# EAGLE schematic ADCS Motherboard (EAGLE 9.6.2)
DESIGNER: Thomas Christison; REV#: B

## Sheet 1 of 4
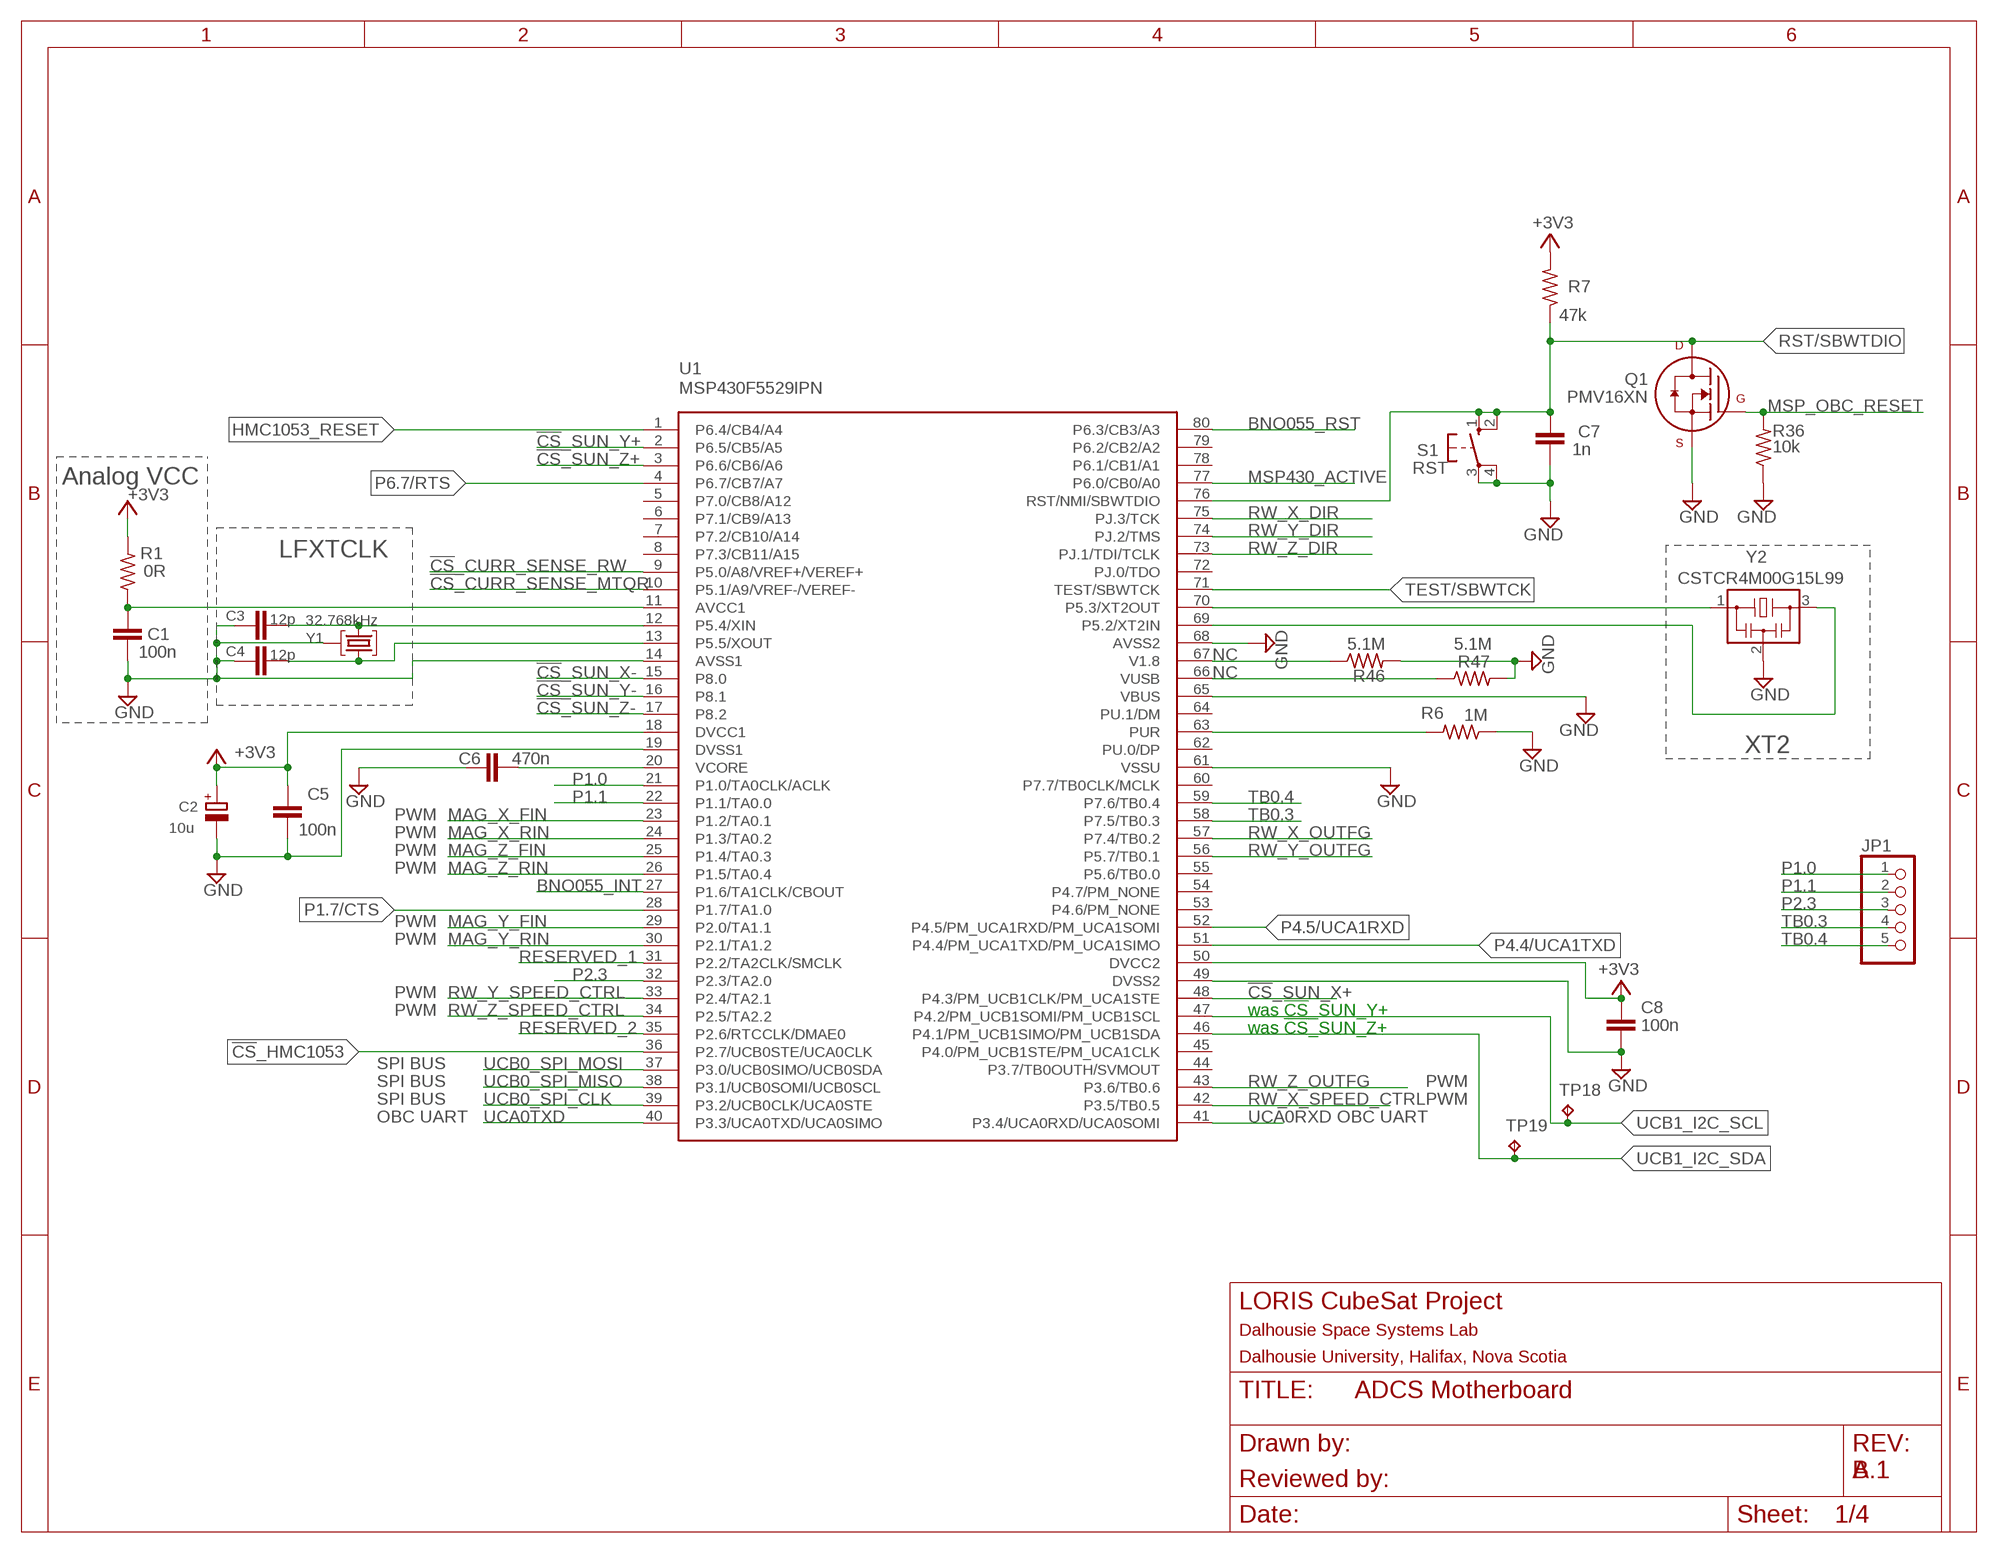
[diagram p0: schematic, sheet 1]

### Parts
C1  100n  C-EUC0402  [C0402]
C2  10u  POLARIZED_CAP  [A/3216-18R]
C3  12p  C-EUC0402  [C0402]
C4  12p  C-EUC0402  [C0402]
C5  100n  C-EUC0402  [C0402]
C6  470n  C-EUC0402  [C0402]
C7  1n  C-EUC0402  [C0402]
C8  100n  C-EUC0402  [C0402]
JP1  PINHD-1X5  [1X05]
Q1  PMV16XN  [SOT23-3P95_230X110L20X43N_PMV16XN]
R1  0R  R-US_R0402  [R0402]
R6  1M  R-US_R0603  [R0603]
R7  47k  R-US_R0402  [R0402]
R36  10k  R-US_R0603  [R0603]
R46  5.1M  R-US_R0402  [R0402]
R47  5.1M  R-US_R0402  [R0402]
S1  RST  10-XX  [B3F-10XX]
TP18  TESTPOINT  [TP_P76H50]
TP19  TESTPOINT  [TP_P76H50]
U1  MSP430F5529IPN  [QFP80P50_1400X1400X160L60X22N]
Y1  32.768kHz  MS3V-T1R  [MS3V-T1R]
Y2  CSTCR4M00G15L99  CSTCR4M00G15L996M00G53Z  [MURATA-FILTER_CSTCR]

### Nets
!CS!_CURR_SENSE_MTQR: U1.10(P5.1/A9/VREF-/VEREF-) ; also sheet 2
!CS!_CURR_SENSE_RW: U1.9(P5.0/A8/VREF+/VEREF+) ; also sheet 2
!CS!_HMC1053: U1.36(P2.7/UCB0STE/UCA0CLK) ; also sheet 3
!CS!_SUN_X+: U1.48(P4.3/PM_UCB1CLK/PM_UCA1STE) ; also sheet 2
!CS!_SUN_X-: U1.15(P8.0) ; also sheet 2
!CS!_SUN_Y+: U1.2(P6.5/CB5/A5) ; also sheet 2
!CS!_SUN_Y-: U1.16(P8.1) ; also sheet 2
!CS!_SUN_Z+: U1.3(P6.6/CB6/A6) ; also sheet 2
!CS!_SUN_Z-: U1.17(P8.2) ; also sheet 2
+3V3: C2.+ C5.2 C8.1 R1.2 R7.2 U1.18(DVCC1) U1.50(DVCC2) ; also sheet 2,3,4
AVCC1 [Power]: C1.1 R1.1 U1.11(AVCC1)
BNO055_INT: U1.27(P1.6/TA1CLK/CBOUT) ; also sheet 4
BNO055_RST: U1.80(P6.3/CB3/A3) ; also sheet 4
GND: C1.2 C2.- C3.1 C4.1 C5.1 C6.1 C7.2 C8.2 Q1.2(S) R6.1 R36.1 R46.2 R47.2 S1.3(P) S1.4(P1) U1.14(AVSS1) U1.19(DVSS1) U1.49(DVSS2) U1.61(VSSU) U1.65(VBUS) U1.68(AVSS2) Y1.P3(GND) Y2.2 ; also sheet 2,3,4
HMC1053_RESET: U1.1(P6.4/CB4/A4) ; also sheet 3
MAG_X_FIN: U1.23(P1.2/TA0.1) ; also sheet 2
MAG_X_RIN: U1.24(P1.3/TA0.2) ; also sheet 2
MAG_Y_FIN: U1.29(P2.0/TA1.1) ; also sheet 2
MAG_Y_RIN: U1.30(P2.1/TA1.2) ; also sheet 2
MAG_Z_FIN: U1.25(P1.4/TA0.3) ; also sheet 2
MAG_Z_RIN: U1.26(P1.5/TA0.4) ; also sheet 2
MSP430_ACTIVE: U1.77(P6.0/CB0/A0) ; also sheet 2
MSP_OBC_RESET: Q1.1(G) R36.2 ; also sheet 2
N$34: R46.1 U1.67(V1.8)
N$38: R47.1 U1.66(VUSB)
P1.0: JP1.1 U1.21(P1.0/TA0CLK/ACLK)
P1.1: JP1.2 U1.22(P1.1/TA0.0)
P1.7/CTS: U1.28(P1.7/TA1.0) ; also sheet 2
P2.3: JP1.3 U1.32(P2.3/TA2.0)
P4.4/UCA1TXD: U1.51(P4.4/PM_UCA1TXD/PM_UCA1SIMO) ; also sheet 2
P4.5/UCA1RXD: U1.52(P4.5/PM_UCA1RXD/PM_UCA1SOMI) ; also sheet 2
P5.2/XT2IN1: U1.69(P5.2/XT2IN) Y2.3
P5.3/XT2OUT1: U1.70(P5.3/XT2OUT) Y2.1
P5.4/XIN1: C3.2 U1.12(P5.4/XIN) Y1.P2
P5.5/XOUT1: C4.2 U1.13(P5.5/XOUT) Y1.P1
P6.7/RTS: U1.4(P6.7/CB7/A7) ; also sheet 2
RESERVED_1: U1.31(P2.2/TA2CLK/SMCLK) ; also sheet 2
RESERVED_2: U1.35(P2.6/RTCCLK/DMAE0) ; also sheet 2
RST/SBWTDIO: C7.1 Q1.3(D) R7.1 S1.1(S) S1.2(S1) U1.76(RST/NMI/SBWTDIO) ; also sheet 2
RW_X_DIR: U1.75(PJ.3/TCK) ; also sheet 2
RW_X_OUTFG: U1.57(P7.4/TB0.2) ; also sheet 2
RW_X_SPEED_CTRL: U1.42(P3.5/TB0.5) ; also sheet 2
RW_Y_DIR: U1.74(PJ.2/TMS) ; also sheet 2
RW_Y_OUTFG: U1.56(P5.7/TB0.1) ; also sheet 2
RW_Y_SPEED_CTRL: U1.33(P2.4/TA2.1) ; also sheet 2
RW_Z_DIR: U1.73(PJ.1/TDI/TCLK) ; also sheet 2
RW_Z_OUTFG: U1.43(P3.6/TB0.6) ; also sheet 2
RW_Z_SPEED_CTRL: U1.34(P2.5/TA2.2) ; also sheet 2
TARGET_PUR: R6.2 U1.63(PUR)
TB0.3: JP1.4 U1.58(P7.5/TB0.3)
TB0.4: JP1.5 U1.59(P7.6/TB0.4)
TEST/SBWTCK: U1.71(TEST/SBWTCK) ; also sheet 2
UCA0RXD: U1.41(P3.4/UCA0RXD/UCA0SOMI) ; also sheet 2
UCA0TXD: U1.40(P3.3/UCA0TXD/UCA0SIMO) ; also sheet 2
UCB0_SPI_CLK: U1.39(P3.2/UCB0CLK/UCA0STE) ; also sheet 2,3
UCB0_SPI_MISO: U1.38(P3.1/UCB0SOMI/UCB0SCL) ; also sheet 2,3
UCB0_SPI_MOSI: U1.37(P3.0/UCB0SIMO/UCB0SDA) ; also sheet 2,3
UCB1_I2C_SCL: TP18.1(TP) U1.47(P4.2/PM_UCB1SOMI/PM_UCB1SCL) ; also sheet 4
UCB1_I2C_SDA: TP19.1(TP) U1.46(P4.1/PM_UCB1SIMO/PM_UCB1SDA) ; also sheet 4
VCORE1 [Power]: C6.2 U1.20(VCORE)
Unconnected: U1.5(P7.0/CB8/A12) U1.6(P7.1/CB9/A13) U1.7(P7.2/CB10/A14) U1.8(P7.3/CB11/A15) U1.44(P3.7/TB0OUTH/SVMOUT) U1.45(P4.0/PM_UCB1STE/PM_UCA1CLK) U1.53(P4.6/PM_NONE) U1.54(P4.7/PM_NONE) U1.55(P5.6/TB0.0) U1.60(P7.7/TB0CLK/MCLK) U1.62(PU.0/DP) U1.64(PU.1/DM) U1.72(PJ.0/TDO) U1.78(P6.1/CB1/A1) U1.79(P6.2/CB2/A2)

### Notes on the sheet
- Analog VCC
- LFXTCLK
- NC
- NC
- XT2
- PWM
- PWM
- PWM
- PWM
- PWM
- PWM
- PWM
- PWM | was !CS!_SUN_Y+
- was !CS!_SUN_Z+
- SPI BUS
- SPI BUS | PWM
- SPI BUS | PWM
- OBC UART | OBC UART
- A.1

## Sheet 2 of 4
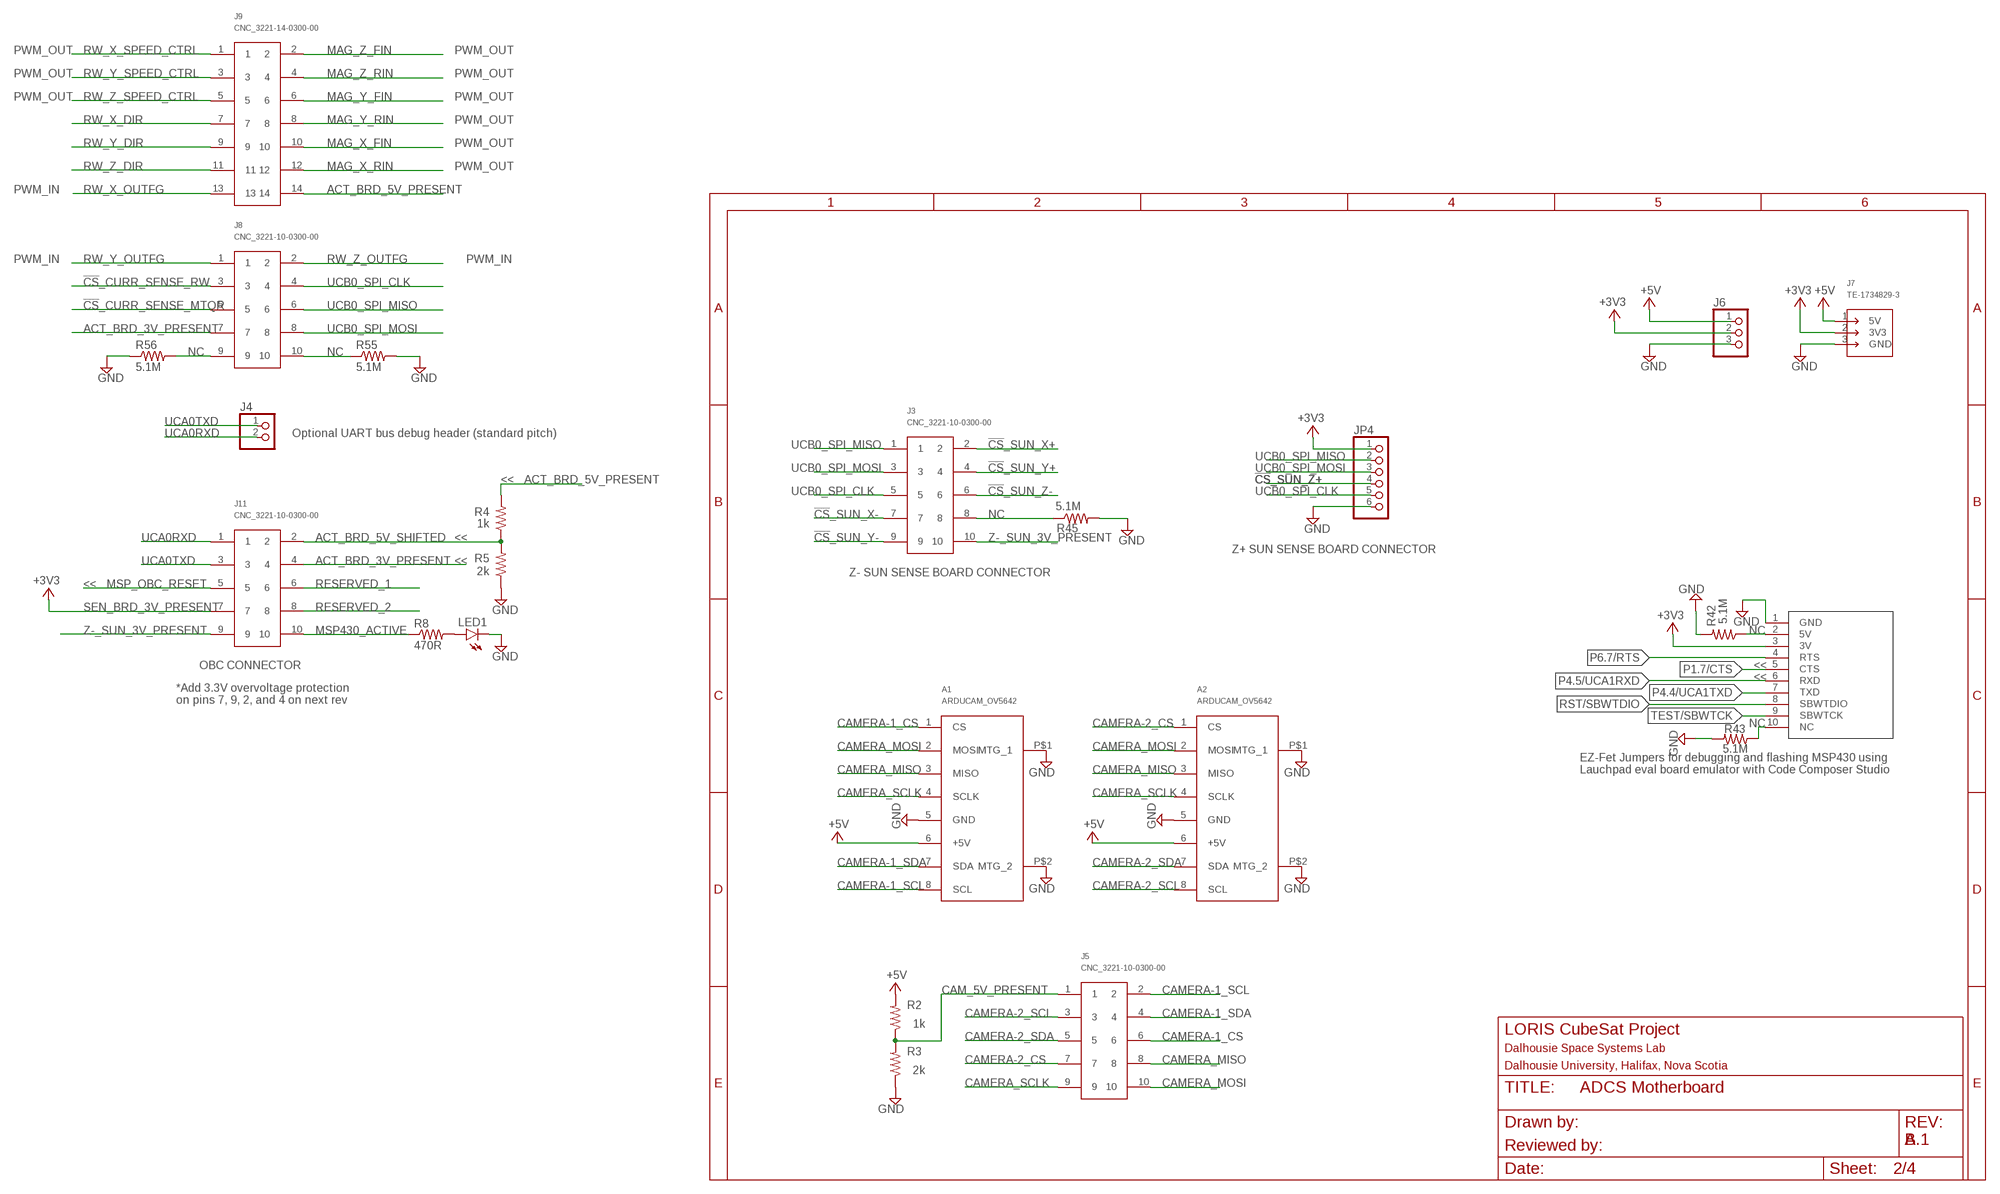
[diagram p1: schematic, sheet 2]

### Parts
A1  ARDUCAM_OV5642  [ARDUCAM]
A2  ARDUCAM_OV5642  [ARDUCAM]
J1  HDR_10_EZFET_DEBUGGER  [HDRV10W66P254_10X1_2540X254H858]
J3  CNC_3221-10-0300-00  [CNC_3221-10-0300-00]
J4  HDR_1X2_  [1X02]
J5  CNC_3221-10-0300-00  [CNC_3221-10-0300-00]
J6  PINHD-1X3  [1X03]
J7  TE-1734829-3  [TE-1734829-3]
J8  CNC_3221-10-0300-00  [CNC_3221-10-0300-00]
J9  CNC_3221-14-0300-00  [CNC_3221-14-0300-00]
J11  CNC_3221-10-0300-00  [CNC_3221-10-0300-00]
JP4  PINHD-1X6  [1X06]
LED1  LEDCHIP-LED0603  [CHIP-LED0603]
R2  1k  R-US_R0603  [R0603]
R3  2k  R-US_R0603  [R0603]
R4  1k  R-US_R0603  [R0603]
R5  2k  R-US_R0603  [R0603]
R8  470R  R-US_R0603  [R0603]
R42  5.1M  R-US_R0402  [R0402]
R43  5.1M  R-US_R0402  [R0402]
R45  5.1M  R-US_R0402  [R0402]
R55  5.1M  R-US_R0603  [R0603]
R56  5.1M  R-US_R0603  [R0603]

### Nets
!CS!_CURR_SENSE_MTQR: J8.5 ; also sheet 1
!CS!_CURR_SENSE_RW: J8.3 ; also sheet 1
!CS!_SUN_X+: J3.2 ; also sheet 1
!CS!_SUN_X-: J3.7 ; also sheet 1
!CS!_SUN_Y+: J3.4 ; also sheet 1
!CS!_SUN_Y-: J3.9 ; also sheet 1
!CS!_SUN_Z+: JP4.4 ; also sheet 1
!CS!_SUN_Z-: J3.6 ; also sheet 1
+3V3: J1.3(3V) J6.2 J7.2(3V3) J11.7 JP4.1 ; also sheet 1,3,4
+5V: A1.6(+5V) A2.6(+5V) J6.1 J7.1(5V) R2.2 ; also sheet 4
ACT_BRD_3V_PRESENT: J8.7 J11.4
ACT_BRD_5V_PRESENT: J9.14 R4.2
ACT_BRD_5V_SHIFTED: J11.2 R4.1 R5.2
CAM_5V_PRESENT: J5.1 R2.1 R3.2
CAMERA-1_CS: A1.1(CS) J5.6
CAMERA-1_SCL: A1.8(SCL) J5.2
CAMERA-1_SDA: A1.7(SDA) J5.4
CAMERA-2_CS: A2.1(CS) J5.7
CAMERA-2_SCL: A2.8(SCL) J5.3
CAMERA-2_SDA: A2.7(SDA) J5.5
CAMERA_MISO: A1.3(MISO) A2.3(MISO) J5.8
CAMERA_MOSI: A1.2(MOSI) A2.2(MOSI) J5.10
CAMERA_SCLK: A1.4(SCLK) A2.4(SCLK) J5.9
GND: A1.5(GND) A1.P$1(MTG_1) A1.P$2(MTG_2) A2.5(GND) A2.P$1(MTG_1) A2.P$2(MTG_2) J1.1(GND) J6.3 J7.3(GND) JP4.6 LED1.C R3.1 R5.1 R42.2 R43.2 R45.2 R55.2 R56.1 ; also sheet 1,3,4
MAG_X_FIN: J9.10 ; also sheet 1
MAG_X_RIN: J9.12 ; also sheet 1
MAG_Y_FIN: J9.6 ; also sheet 1
MAG_Y_RIN: J9.8 ; also sheet 1
MAG_Z_FIN: J9.2 ; also sheet 1
MAG_Z_RIN: J9.4 ; also sheet 1
MSP430_ACTIVE: J11.10 R8.1 ; also sheet 1
MSP_OBC_RESET: J11.5 ; also sheet 1
N$4: LED1.A R8.2
N$32: J1.2(5V) R42.1
N$33: J1.10(NC) R43.1
N$55: J8.9 R56.2
N$57: J8.10 R55.1
N$58: J3.8 R45.1
P1.7/CTS: J1.5(CTS) ; also sheet 1
P4.4/UCA1TXD: J1.7(TXD) ; also sheet 1
P4.5/UCA1RXD: J1.6(RXD) ; also sheet 1
P6.7/RTS: J1.4(RTS) ; also sheet 1
RESERVED_1: J11.6 ; also sheet 1
RESERVED_2: J11.8 ; also sheet 1
RST/SBWTDIO: J1.8(SBWTDIO) ; also sheet 1
RW_X_DIR: J9.7 ; also sheet 1
RW_X_OUTFG: J9.13 ; also sheet 1
RW_X_SPEED_CTRL: J9.1 ; also sheet 1
RW_Y_DIR: J9.9 ; also sheet 1
RW_Y_OUTFG: J8.1 ; also sheet 1
RW_Y_SPEED_CTRL: J9.3 ; also sheet 1
RW_Z_DIR: J9.11 ; also sheet 1
RW_Z_OUTFG: J8.2 ; also sheet 1
RW_Z_SPEED_CTRL: J9.5 ; also sheet 1
TEST/SBWTCK: J1.9(SBWTCK) ; also sheet 1
UCA0RXD: J4.2 J11.1 ; also sheet 1
UCA0TXD: J4.1 J11.3 ; also sheet 1
UCB0_SPI_CLK: J3.5 J8.4 JP4.5 ; also sheet 1,3
UCB0_SPI_MISO: J3.1 J8.6 JP4.2 ; also sheet 1,3
UCB0_SPI_MOSI: J3.3 J8.8 JP4.3 ; also sheet 1,3
Z-_SUN_3V_PRESENT: J3.10 J11.9

### Notes on the sheet
- PWM_OUT | PWM_OUT
- PWM_OUT | PWM_OUT
- PWM_OUT | PWM_OUT
- PWM_OUT
- PWM_OUT
- PWM_OUT
- PWM_IN
- PWM_IN | PWM_IN
- NC | NC
- Optional UART bus debug header (standard pitch)
- <<
- NC
- <<
- Z+ SUN SENSE BOARD CONNECTOR
- <<
- Z- SUN SENSE BOARD CONNECTOR
- <<
- SEN_BRD_3V_PRESENT
- NC
- OBC CONNECTOR | <<
- <<
- *Add 3.3V overvoltage protection 
  on pins 7, 9, 2, and 4 on next rev
- NC
- EZ-Fet Jumpers for debugging and flashing MSP430 using 
  Lauchpad eval board emulator with Code Composer Studio
- A.1

## Sheet 3 of 4
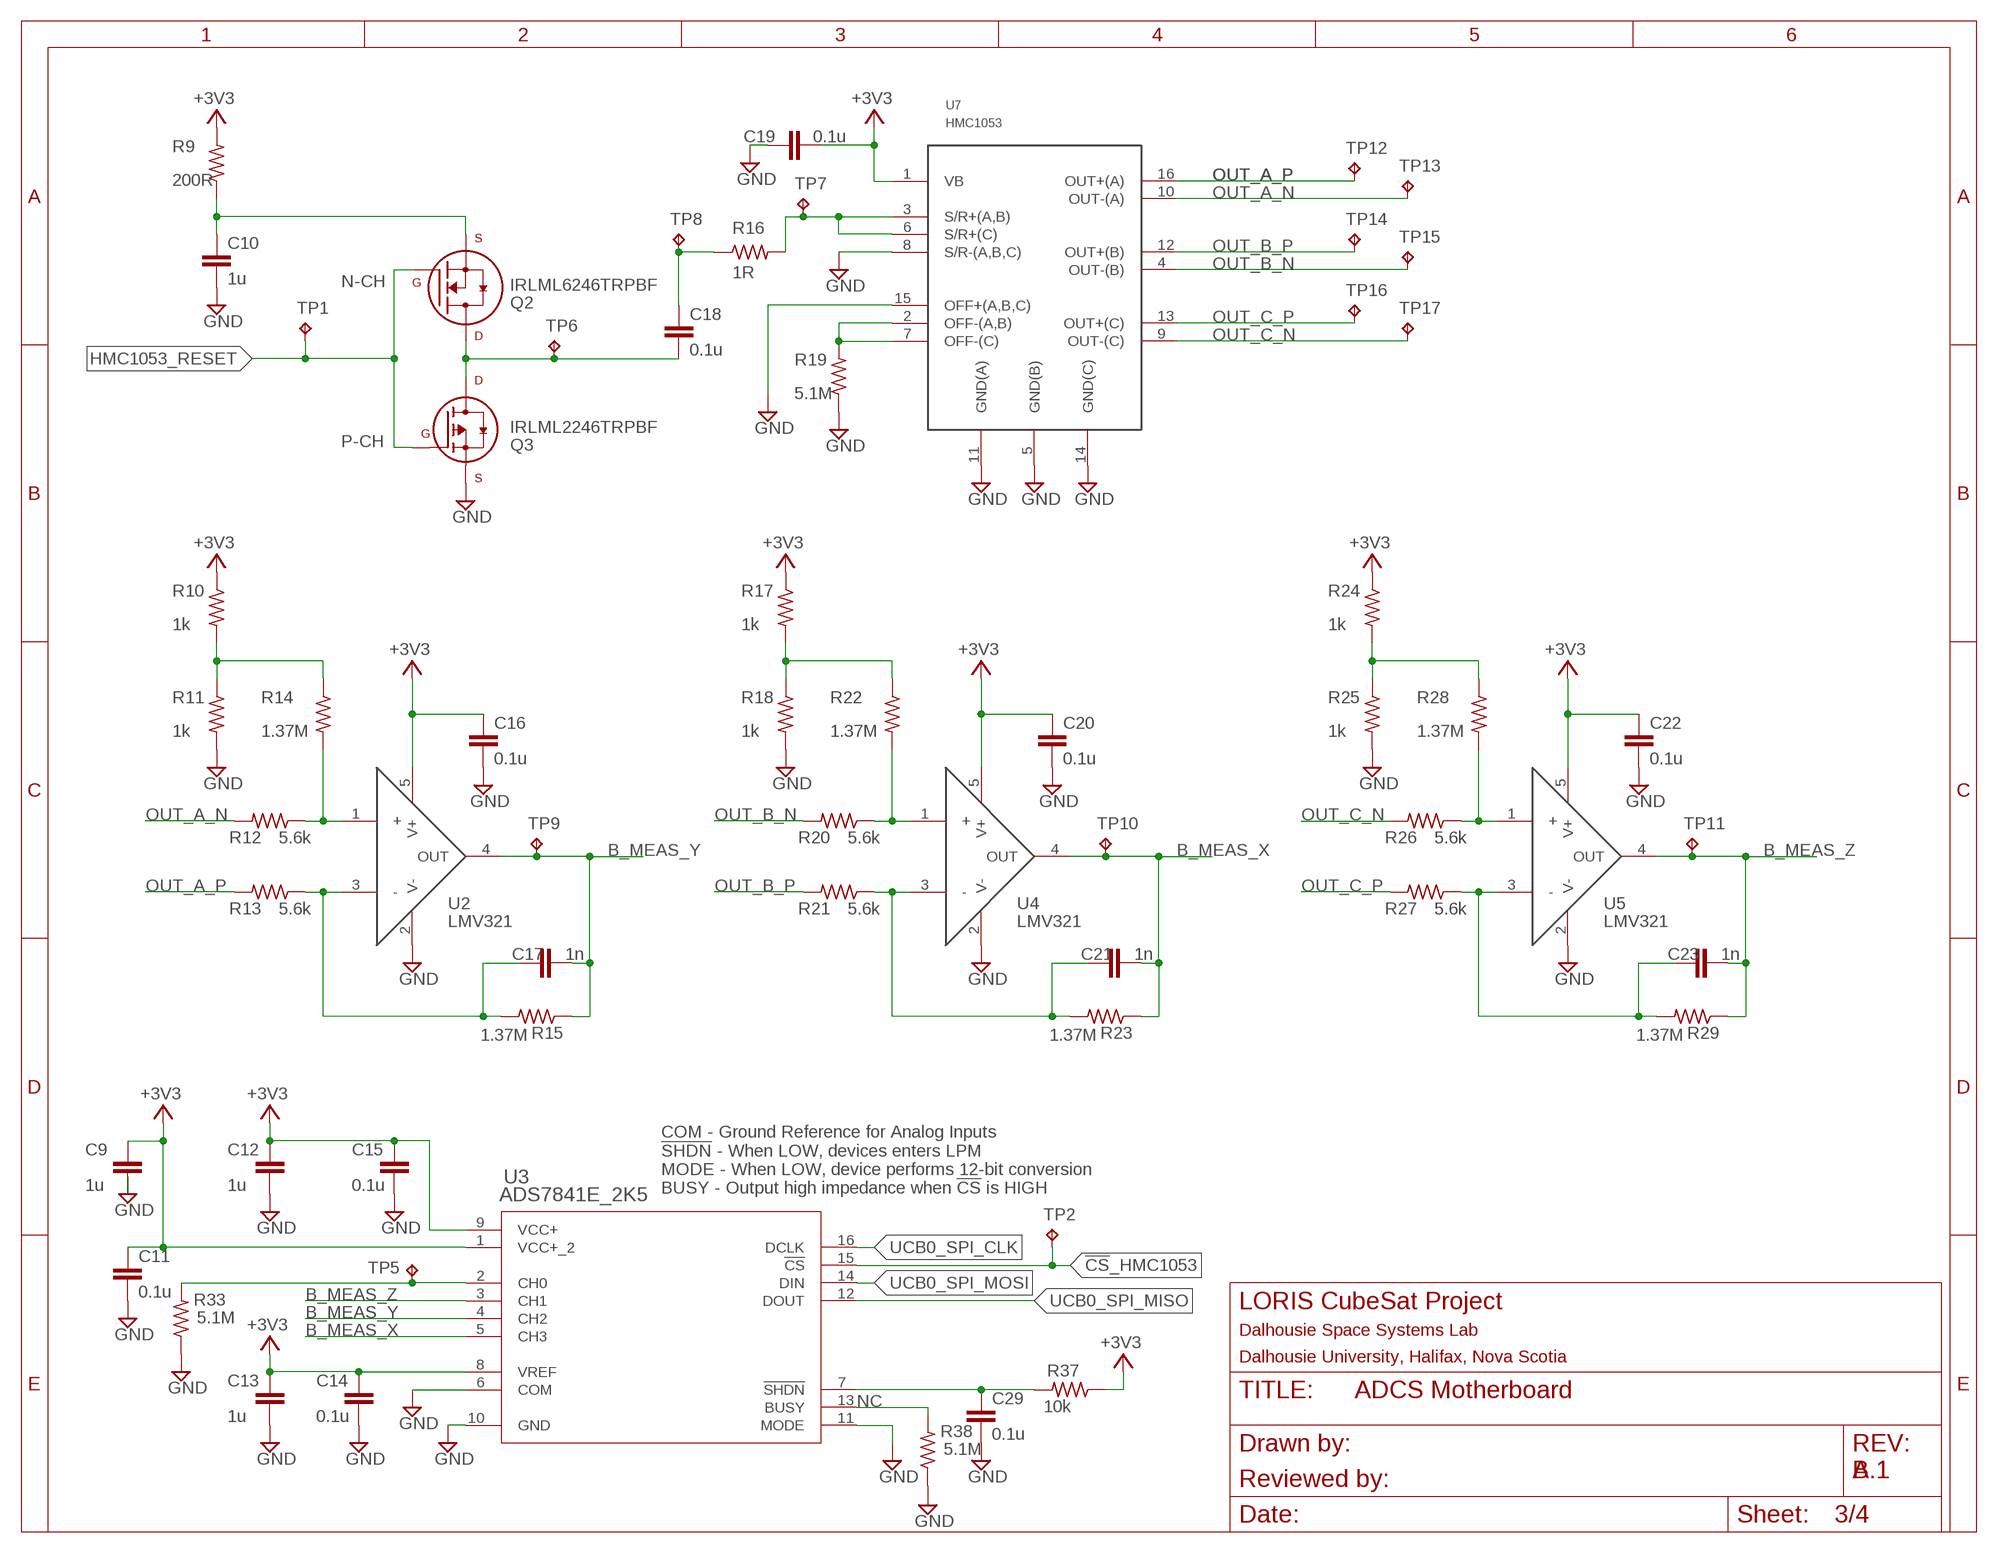
[diagram p2: schematic, sheet 3]

### Parts
C9  1u  C-EUC0805  [C0805]
C10  1u  C-EUC0603  [C0603]
C11  0.1u  C-EUC0603  [C0603]
C12  1u  C-EUC0805  [C0805]
C13  1u  C-EUC0805  [C0805]
C14  0.1u  C-EUC0603  [C0603]
C15  0.1u  C-EUC0603  [C0603]
C16  0.1u  C-EUC0603  [C0603]
C17  1n  C-EUC0603  [C0603]
C18  0.1u  C-EUC0805  [C0805]
C19  0.1u  C-EUC0603  [C0603]
C20  0.1u  C-EUC0603  [C0603]
C21  1n  C-EUC0603  [C0603]
C22  0.1u  C-EUC0603  [C0603]
C23  1n  C-EUC0603  [C0603]
C29  0.1u  C-EUC0603  [C0603]
Q2  IRLML6246TRPBF  [SOT23-3P95_237X112L25X40N_MICRO3]
Q3  IRLML2246TRPBF  [SOT23-3P95_237X112L25X40N_MICRO3]
R9  200R  R-US_R0805  [R0805]
R10  1k  R-US_R0603  [R0603]
R11  1k  R-US_R0603  [R0603]
R12  5.6k  R-US_R0603  [R0603]
R13  5.6k  R-US_R0603  [R0603]
R14  1.37M  R-US_R0603  [R0603]
R15  1.37M  R-US_R0603  [R0603]
R16  1R  R-US_R0805  [R0805]
R17  1k  R-US_R0603  [R0603]
R18  1k  R-US_R0603  [R0603]
R19  5.1M  R-US_R0805  [R0805]
R20  5.6k  R-US_R0603  [R0603]
R21  5.6k  R-US_R0603  [R0603]
R22  1.37M  R-US_R0603  [R0603]
R23  1.37M  R-US_R0603  [R0603]
R24  1k  R-US_R0603  [R0603]
R25  1k  R-US_R0603  [R0603]
R26  5.6k  R-US_R0603  [R0603]
R27  5.6k  R-US_R0603  [R0603]
R28  1.37M  R-US_R0603  [R0603]
R29  1.37M  R-US_R0603  [R0603]
R33  5.1M  R-US_R0402  [R0402]
R37  10k  R-US_R0805  [R0805]
R38  5.1M  R-US_R0402  [R0402]
TP1  TESTPOINT  [TP_P76H50]
TP2  TESTPOINT  [TP_P76H50]
TP5  TESTPOINT  [TP_P76H50]
TP6  TESTPOINT  [TP_P76H50]
TP7  TESTPOINT  [TP_P76H50]
TP8  TESTPOINT  [TP_P76H50]
TP9  TESTPOINT  [TP_P76H50]
TP10  TESTPOINT  [TP_P76H50]
TP11  TESTPOINT  [TP_P76H50]
TP12  TESTPOINT  [TP_P76H50]
TP13  TESTPOINT  [TP_P76H50]
TP14  TESTPOINT  [TP_P76H50]
TP15  TESTPOINT  [TP_P76H50]
TP16  TESTPOINT  [TP_P76H50]
TP17  TESTPOINT  [TP_P76H50]
U2  LMV321  [SC70-5P65_210X110L36X22N]
U3  ADS7841E_2K5  [DBQ16]
U4  LMV321  [SC70-5P65_210X110L36X22N]
U5  LMV321  [SC70-5P65_210X110L36X22N]
U7  HMC1053  [LCCS16P127_736X736X279L127X50N]

### Nets
!CS!_HMC1053: TP2.1(TP) U3.15(!CS) ; also sheet 1
+3V3: C9.1 C11.1 C12.1 C13.1 C14.1 C15.1 C16.1 C19.1 C20.1 C22.1 R9.2 R10.1 R17.1 R24.1 R37.1 U2.5(V+) U3.1(VCC+_2) U3.8(VREF) U3.9(VCC+) U4.5(V+) U5.5(V+) U7.1(VB) ; also sheet 1,2,4
B_MEAS_X: C21.2 R23.1 TP10.1(TP) U3.5(CH3) U4.4(OUT)
B_MEAS_Y: C17.2 R15.1 TP9.1(TP) U2.4(OUT) U3.4(CH2)
B_MEAS_Z: C23.2 R29.1 TP11.1(TP) U3.3(CH1) U5.4(OUT)
GND: C9.2 C10.1 C11.2 C12.2 C13.2 C14.2 C15.2 C16.2 C19.2 C20.2 C22.2 C29.2 Q3.2(S) R11.2 R18.2 R19.1 R25.2 R33.1 R38.1 U2.2(V-) U3.6(COM) U3.10(GND) U3.11(MODE) U4.2(V-) U5.2(V-) U7.5(GND(B)) U7.8(S/R-(A,B,C)) U7.11(GND(A)) U7.14(GND(C)) U7.15(OFF+(A,B,C)) ; also sheet 1,2,4
HMC1053_RESET: Q2.1(G) Q3.1(G) TP1.1(TP) ; also sheet 1
N$9: C18.1 Q2.3(D) Q3.3(D) TP6.1(TP)
N$20: R10.2 R11.1 R14.1
N$21: C17.1 R13.1 R15.2 U2.3(-)
N$23: R12.1 R14.2 U2.1(+)
N$29: R33.2 TP5.1(TP) U3.2(CH0)
N$30: R38.2 U3.13(BUSY)
N$31: C29.1 R37.2 U3.7(!SHDN)
N$35: C18.2 R16.1 TP8.1(TP)
N$36: R19.2 U7.2(OFF-(A,B)) U7.7(OFF-(C))
N$37: R16.2 TP7.1(TP) U7.3(S/R+(A,B)) U7.6(S/R+(C))
N$39: C10.2 Q2.2(S) R9.1
N$49: R17.2 R18.1 R22.1
N$50: C21.1 R21.1 R23.2 U4.3(-)
N$52: R20.1 R22.2 U4.1(+)
N$59: R24.2 R25.1 R28.1
N$60: C23.1 R27.1 R29.2 U5.3(-)
N$62: R26.1 R28.2 U5.1(+)
OUT_A_N: R12.2 TP13.1(TP) U7.10(OUT-(A))
OUT_A_P: R13.2 TP12.1(TP) U7.16(OUT+(A))
OUT_B_N [Ground]: R20.2 TP15.1(TP) U7.4(OUT-(B))
OUT_B_P [Ground]: R21.2 TP14.1(TP) U7.12(OUT+(B))
OUT_C_N [Ground]: R26.2 TP17.1(TP) U7.9(OUT-(C))
OUT_C_P [Ground]: R27.2 TP16.1(TP) U7.13(OUT+(C))
UCB0_SPI_CLK: U3.16(DCLK) ; also sheet 1,2
UCB0_SPI_MISO: U3.12(DOUT) ; also sheet 1,2
UCB0_SPI_MOSI: U3.14(DIN) ; also sheet 1,2

### Notes on the sheet
- N-CH
- P-CH
- COM - Ground Reference for Analog Inputs
  !SHDN! - When LOW, devices enters LPM
  MODE - When LOW, device performs 12-bit conversion
  BUSY - Output high impedance when !CS! is HIGH
- NC
- A.1

## Sheet 4 of 4
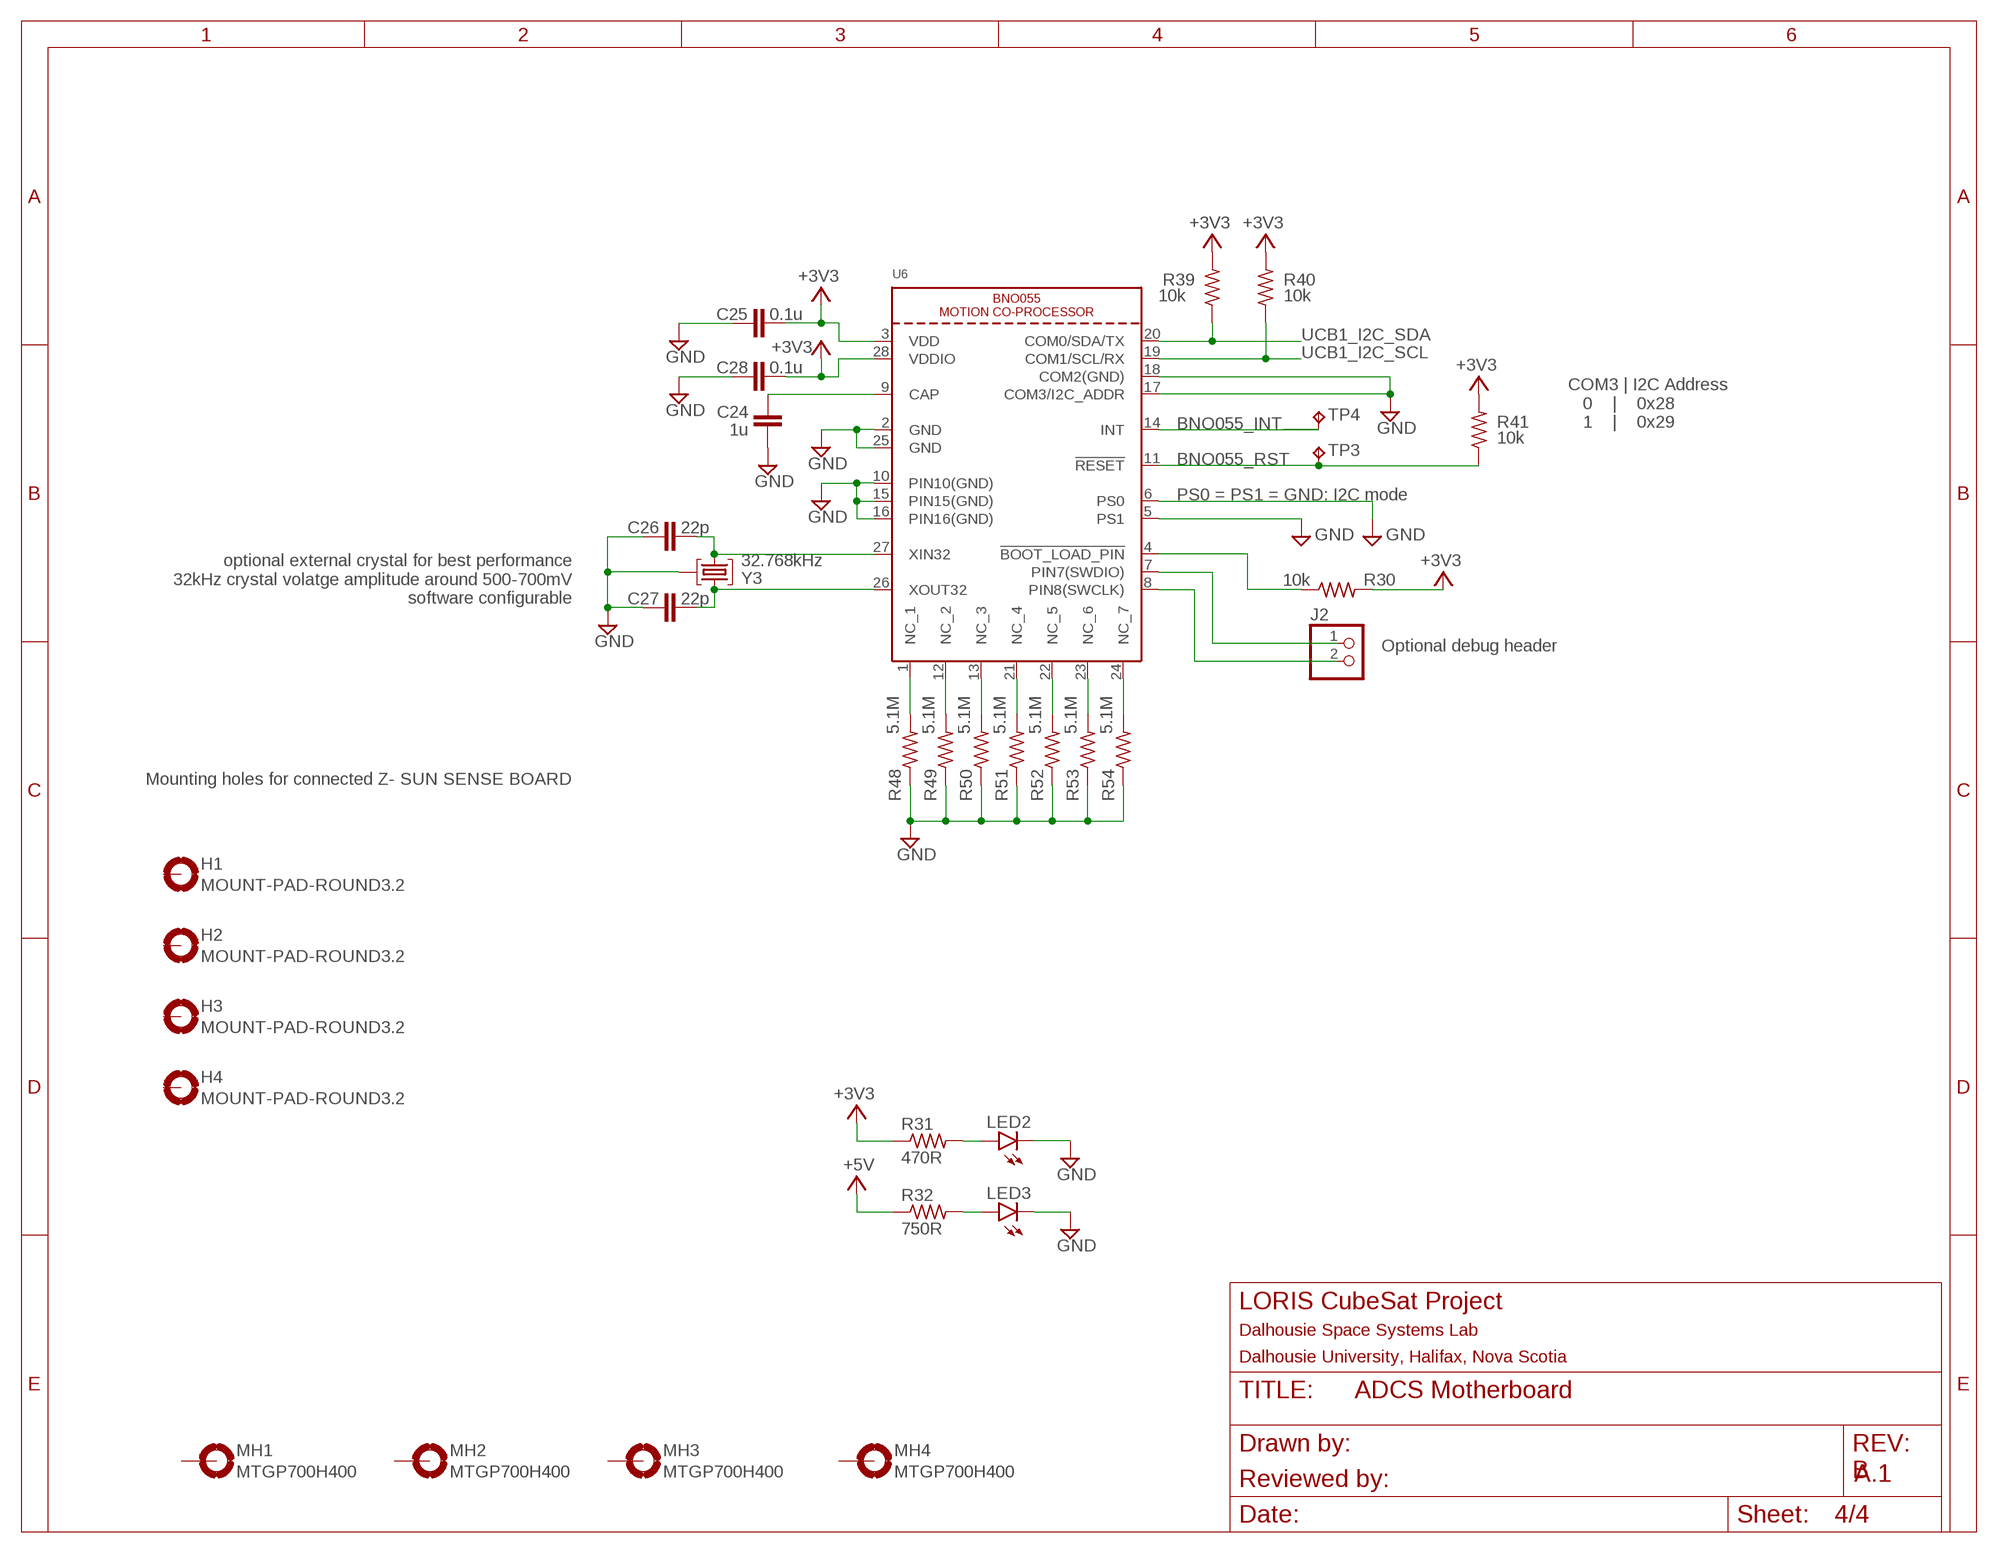
[diagram p3: schematic, sheet 4]

### Parts
C24  1u  C-EUC0402  [C0402]
C25  0.1u  C-EUC0402  [C0402]
C26  22p  C-EUC0402  [C0402]
C27  22p  C-EUC0402  [C0402]
C28  0.1u  C-EUC0402  [C0402]
H1  MOUNT-PAD-ROUND3.2  [3,2-PAD]
H2  MOUNT-PAD-ROUND3.2  [3,2-PAD]
H3  MOUNT-PAD-ROUND3.2  [3,2-PAD]
H4  MOUNT-PAD-ROUND3.2  [3,2-PAD]
J2  HDR_1X2_  [1X02]
LED2  LEDCHIP-LED0603  [CHIP-LED0603]
LED3  LEDCHIP-LED0603  [CHIP-LED0603]
MH1  MTGP700H400  [MTGP700H400]
MH2  MTGP700H400  [MTGP700H400]
MH3  MTGP700H400  [MTGP700H400]
MH4  MTGP700H400  [MTGP700H400]
R30  10k  R-US_R0402  [R0402]
R31  470R  R-US_R0603  [R0603]
R32  750R  R-US_R0603  [R0603]
R39  10k  R-US_R0402  [R0402]
R40  10k  R-US_R0402  [R0402]
R41  10k  R-US_R0402  [R0402]
R48  5.1M  R-US_R0402  [R0402]
R49  5.1M  R-US_R0402  [R0402]
R50  5.1M  R-US_R0402  [R0402]
R51  5.1M  R-US_R0402  [R0402]
R52  5.1M  R-US_R0402  [R0402]
R53  5.1M  R-US_R0402  [R0402]
R54  5.1M  R-US_R0402  [R0402]
TP3  TESTPOINT  [TP_P76H50]
TP4  TESTPOINT  [TP_P76H50]
U6  BNO055  [BNO055]
Y3  32.768kHz  MS3V-T1R  [MS3V-T1R]

### Nets
+3V3: C25.2 C28.2 R30.2 R31.1 R39.2 R40.2 R41.2 U6.3(VDD) U6.28(VDDIO) ; also sheet 1,2,3
+5V: R32.1 ; also sheet 2
BNO055_INT: TP4.1(TP) U6.14(INT) ; also sheet 1
BNO055_RST: R41.1 TP3.1(TP) U6.11(!RESET) ; also sheet 1
GND: C24.1 C25.1 C26.1 C27.1 C28.1 LED2.C LED3.C R48.1 R49.1 R50.1 R51.1 R52.1 R53.1 R54.1 U6.2(GND) U6.5(PS1) U6.6(PS0) U6.10(PIN10(GND)) U6.15(PIN15(GND)) U6.16(PIN16(GND)) U6.17(COM3/I2C_ADDR) U6.18(COM2(GND)) U6.25(GND) Y3.P3(GND) ; also sheet 1,2,3
N$5: LED2.A R31.2
N$6: LED3.A R32.2
N$7: R30.1 U6.4(!BOOT_LOAD_PIN)
N$13: C24.2 U6.9(CAP)
N$14: C26.2 U6.27(XIN32) Y3.P1
N$15: C27.2 U6.26(XOUT32) Y3.P2
N$16: J2.1 U6.7(PIN7(SWDIO))
N$17: J2.2 U6.8(PIN8(SWCLK))
N$40: R48.2 U6.1(NC_1)
N$42: R49.2 U6.12(NC_2)
N$43: R50.2 U6.13(NC_3)
N$44: R51.2 U6.21(NC_4)
N$45: R52.2 U6.22(NC_5)
N$46: R53.2 U6.23(NC_6)
N$47: R54.2 U6.24(NC_7)
UCB1_I2C_SCL: R40.1 U6.19(COM1/SCL/RX) ; also sheet 1
UCB1_I2C_SDA: R39.1 U6.20(COM0/SDA/TX) ; also sheet 1
Unconnected: H1.B3,2(MOUNT) H2.B3,2(MOUNT) H3.B3,2(MOUNT) H4.B3,2(MOUNT) MH1.1(MOUNT) MH2.1(MOUNT) MH3.1(MOUNT) MH4.1(MOUNT)

### Notes on the sheet
- COM3 | I2C Address
     0    |    0x28
     1    |    0x29
- PS0 = PS1 = GND: I2C mode
- optional external crystal for best performance
  32kHz crystal volatge amplitude around 500-700mV
  software configurable
- Optional debug header
- Mounting holes for connected Z- SUN SENSE BOARD
- A.1

## Library data of the parts
A1 A2 = my_library:ARDUCAM_OV5642
C1 C3-C29 = rcl:C-EU: CAPACITOR, European symbol; SPICEPREFIX: C
C2 = my_library:POLARIZED_CAP
H1-H4 = holes:MOUNT-PAD-ROUND: MOUNTING PAD, round
J1 = my_library:HDR_10_EZFET_DEBUGGER
J2 J4 = my_library:HDR_1X2: JUMPER
J3 J5 J8 J11 = my_library:CNC_3221-10-0300-00
J6 = my_library:PINHD-1X3: PIN HEADER
J7 = my_library:TE-1734829-3
J9 = my_library:CNC_3221-14-0300-00
JP1 = my_library:PINHD-1X5: PIN HEADER
JP4 = my_library:PINHD-1X6: PIN HEADER
LED1-LED3 = led:LED: LED OSRAM: - CHIPLED LG R971, LG N971, LY N971, LG Q971, LY Q971, LO R971, LY R971 LH N974, LH R974 LS Q976, LO Q976, LY Q976 LO Q996 - Hyper CHIPLED LW Q18S LB Q993, LB Q99A, LB R99A - SideLED LS A670, LO A670, LY A670, LG A670, LP A670 LB A673, LV A673, LT A673, LW A673 LH A674 LY A675 LS A676, LA A676, LO A676, LY A676, LW A676 LS A679, LY A679, LG A679 - Hyper Micro SIDELED® LS Y876, LA Y876, LO Y876, LY Y876 LT Y87S - SmartLED LW L88C, LW L88S LB L89C, LB L89S, LG L890 LS L89K, LO L89K, LY L89K LS L896, LA L896, LO L896, LY L896 - TOPLED LS T670, LO T670, LY T670, LG T670, LP T670 LSG T670, LSP T670, LSY T670, LOP T670, LYG T670 LG T671, LOG T671, LSG T671 LB T673, LV T673, LT T673, LW T673 LH T674 LS T676, LA T676, LO T676, LY T676, LB T676, LH T676, LSB T676, LW T676 LB T67C, LV T67C, LT T67C, LS T67K, LO T67K, LY T67K, LW E67C LS E67B, LA E67B, LO E67B, LY E67B, LB E67C, LV E67C, LT E67C LW T67C LS T679, LY T679, LG T679 LS T770, LO T770, LY T770, LG T770, LP T770 LB T773, LV T773, LT T773, LW T773 LH T774 LS E675, LA E675, LY E675, LS T675 LS T776, LA T776, LO T776, LY T776, LB T776 LHGB T686 LT T68C, LB T68C - Hyper Mini TOPLED® LB M676 - Mini TOPLED Santana® LG M470 LS M47K, LO M47K, LY M47K Source: http://www.osram.convergy.de LUXEON: - LUMILED® LXK2-PW12-R00, LXK2-PW12-S00, LXK2-PW14-U00, LXK2-PW14-V00 LXK2-PM12-R00, LXK2-PM12-S00, LXK2-PM14-U00 LXK2-PE12-Q00, LXK2-PE12-R00, LXK2-PE12-S00, LXK2-PE14-T00, LXK2-PE14-U00 LXK2-PB12-K00, LXK2-PB12-L00, LXK2-PB12-M00, LXK2-PB14-N00, LXK2-PB14-P00, LXK2-PB14-Q00 LXK2-PR12-L00, LXK2-PR12-M00, LXK2-PR14-Q00, LXK2-PR14-R00 LXK2-PD12-Q00, LXK2-PD12-R00, LXK2-PD12-S00 LXK2-PH12-R00, LXK2-PH12-S00 LXK2-PL12-P00, LXK2-PL12-Q00, LXK2-PL12-R00 Source: www.luxeon.com KINGBRIGHT: KA-3528ASYC Source: www.kingbright.com
MH1-MH4 = my_library:MTGP700H400
Q1 = my_library:PMV16XN
Q2 = my_library:IRLML6246TRPBF
Q3 = my_library:IRLML2246TRPBF
R1-R33 R36-R43 R45-R56 = rcl:R-US_: RESISTOR, American symbol; SPICEPREFIX: R
S1 = my_library:10-XX: OMRON SWITCH; MPN: B3F-1000; OC_FARNELL: 176432; OC_NEWARK: 36M3542
TP1-TP19 = my_library:TESTPOINT
U1 = my_library:MSP430F5529IPN
U2 U4 U5 = my_library:LMV321
U3 = my_library:ADS7841E_2K5; DATASHEET_URL: http://www.ti.com/lit/gpn/ADS7841; DESCRIPTION: 12-Bit, 4-Channel Serial Output Sampling Analog-to-Digital Converter; FAMILY_NAME: PRECISION ADC (<=10MSPS); GENERIC_PART_NUMBER: ADS7841; INDUSTRY_STD_PKG_TYPE: SSOP/QSOP; MANUFACTURER: Texas Instruments; PACKAGE_DESIGNATOR: DBQ; PIN_COUNT: 16
U6 = my_library:BNO055: BNO055 - Motion Co-Processor
U7 = my_library:HMC1053
Y1 Y3 = my_library:MS3V-T1R
Y2 = my_library:CSTCR4M00G15L99; MPN: CSTCR6M00G53-R0; OC_FARNELL: 1170434; OC_NEWARK: 25M8759

## Net classes
1 Ground: width 0.203 mm, drill 0.305 mm, clearance 0.152 mm to class 0, clearance 0.152 mm
2 Power: width 0.203 mm, drill 0.305 mm, clearance 0.152 mm to class 0, clearance 0.152 mm to class 1, clearance 0.152 mm